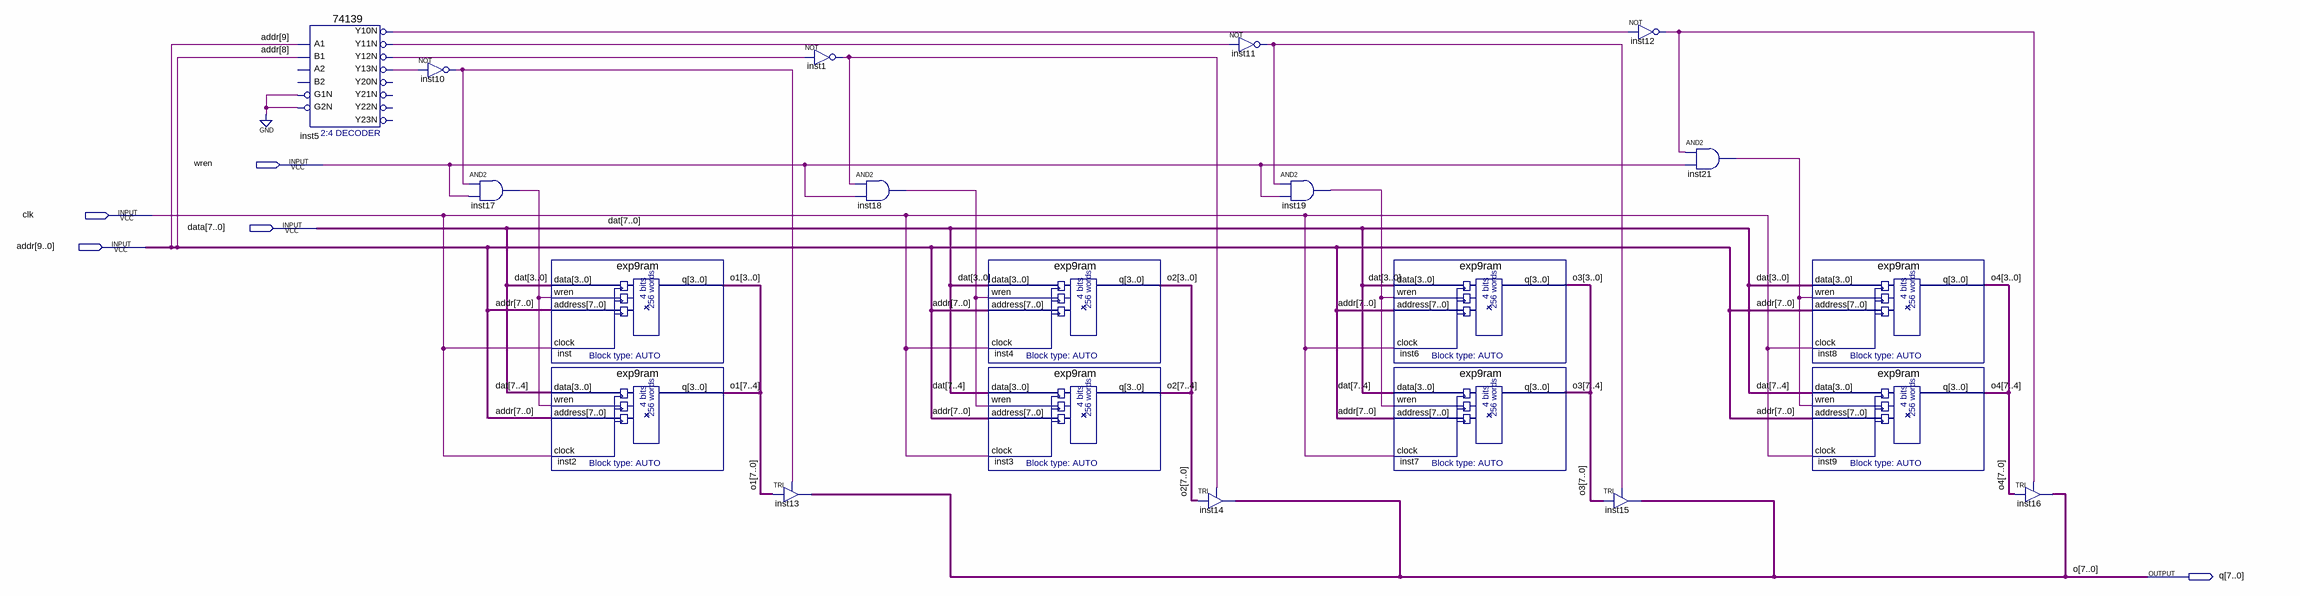
[diagram p0: schematic sheet]
// Quartus schematic exp9.bdf as structural Verilog: 21 symbols, 5 pins
module exp9 (
  input  wren,
  input  clk,
  input  [7:0] data,
  input  [9:0] addr,
  output [7:0] q
);

  wire inst1_out, inst5_y10n, inst5_y11n, inst5_y12n, inst5_y13n, inst10_out, inst11_out, inst12_out,
       inst17_out, inst18_out, inst19_out, inst21_out;
  wire [7:0] o1, o2, o3, o4;

  \74139  inst5 (
    .A1(addr[9]), .B1(addr[8]), .G1N(1'b0), .G2N(1'b0), .Y10N(inst5_y10n), .Y13N(inst5_y13n),
    .Y12N(inst5_y12n), .Y11N(inst5_y11n));  // open: A2, B2, Y20N, Y21N, Y22N, Y23N
  not inst10 (inst10_out, inst5_y13n);
  and inst17 (inst17_out, inst10_out, wren);
  exp9ram inst (.data(data[3:0]), .wren(inst17_out), .address(addr[7:0]), .clock(clk), .q(o1[3:0]));
  exp9ram inst2 (.data(data[7:4]), .wren(inst17_out), .address(addr[7:0]), .clock(clk), .q(o1[7:4]));
  TRI inst13[7:0] (.IN(o1), .OE(inst10_out), .OUT(q));
  not inst1 (inst1_out, inst5_y12n);
  and inst18 (inst18_out, inst1_out, wren);
  exp9ram inst4 (.data(data[3:0]), .wren(inst18_out), .address(addr[7:0]), .clock(clk), .q(o2[3:0]));
  exp9ram inst3 (.data(data[7:4]), .wren(inst18_out), .address(addr[7:0]), .clock(clk), .q(o2[7:4]));
  not inst11 (inst11_out, inst5_y11n);
  TRI inst14[7:0] (.IN(o2), .OE(inst1_out), .OUT(q));
  and inst19 (inst19_out, inst11_out, wren);
  exp9ram inst6 (.data(data[3:0]), .wren(inst19_out), .address(addr[7:0]), .clock(clk), .q(o3[3:0]));
  exp9ram inst7 (.data(data[7:4]), .wren(inst19_out), .address(addr[7:0]), .clock(clk), .q(o3[7:4]));
  not inst12 (inst12_out, inst5_y10n);
  TRI inst15[7:0] (.IN(o3), .OE(inst11_out), .OUT(q));
  and inst21 (inst21_out, inst12_out, wren);
  exp9ram inst8 (.data(data[3:0]), .wren(inst21_out), .address(addr[7:0]), .clock(clk), .q(o4[3:0]));
  exp9ram inst9 (.data(data[7:4]), .wren(inst21_out), .address(addr[7:0]), .clock(clk), .q(o4[7:4]));
  TRI inst16[7:0] (.IN(o4), .OE(inst12_out), .OUT(q));

  // Other names for the same wires on the sheet: dat[7:0] = data; o[7:0] = q
endmodule
